# EAGLE design Adafruit Audio BFF PCB (EAGLE 9.6.2)
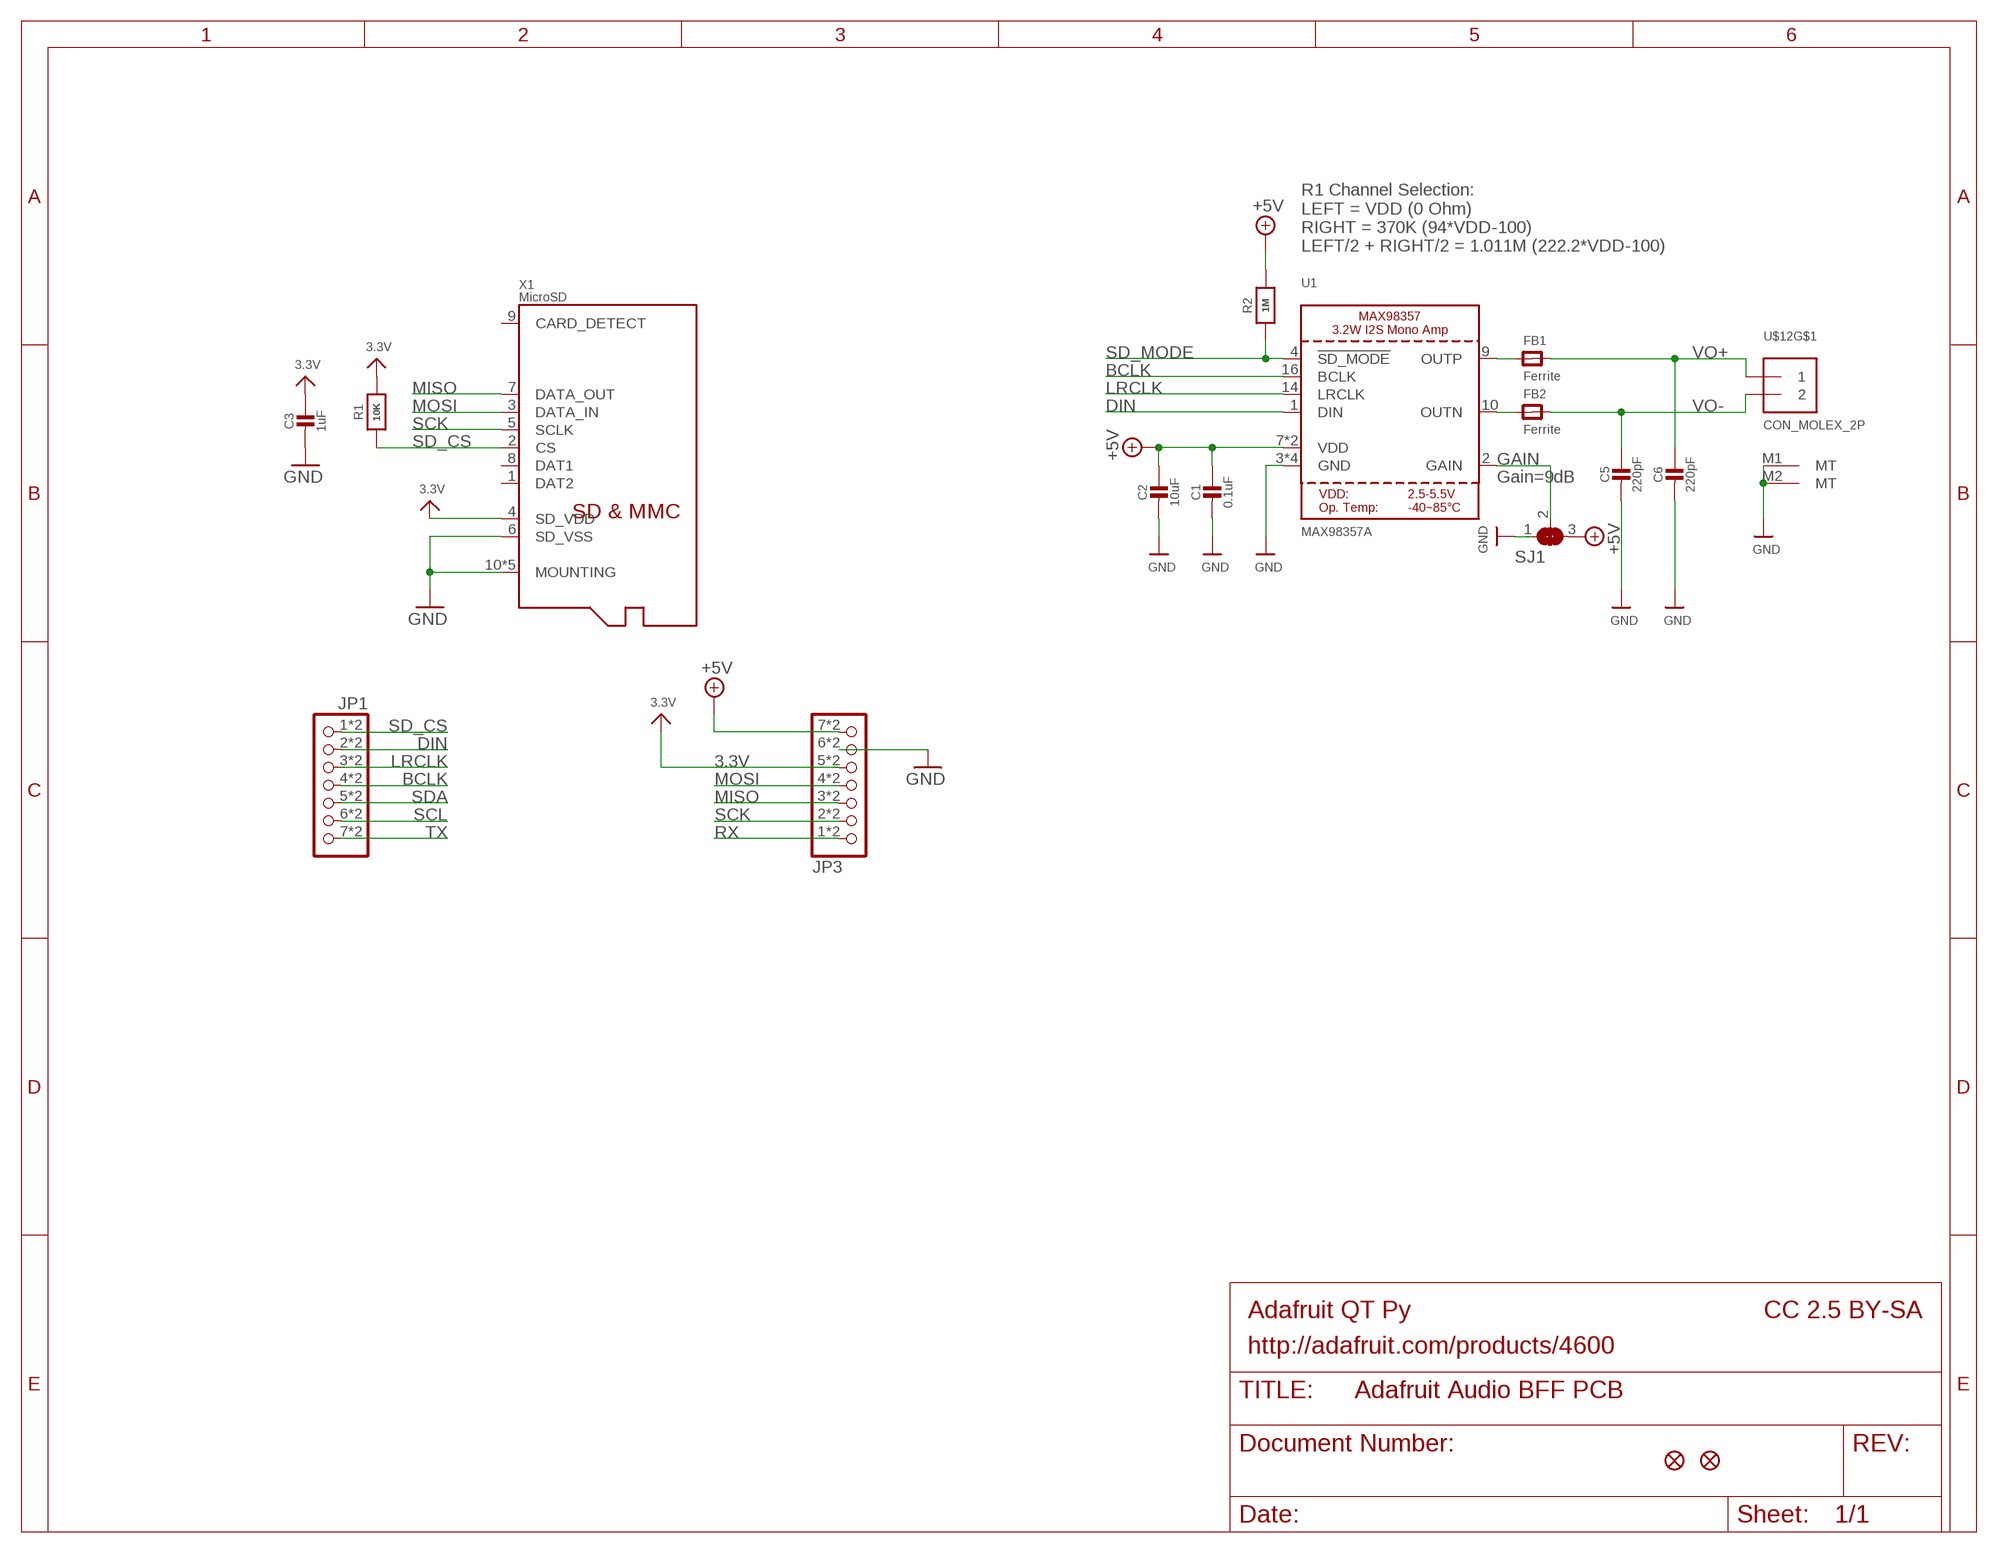
[diagram p0: schematic, sheet 1]

## Parts
C1  0.1uF  CAP_CERAMIC_0402NO  [_0402NO]
C2  10uF  CAP_CERAMIC0805-NOOUTLINE  [0805-NO]
C3  1uF  CAP_CERAMIC_0402NO  [_0402NO]
C5  220pF  CAP_CERAMIC_0402NO  [_0402NO]
C6  220pF  CAP_CERAMIC_0402NO  [_0402NO]
FB1  Ferrite  FERRITE_0402  [_0402]
FB2  Ferrite  FERRITE_0402  [_0402]
JP1  HEADER-1X7_CASTEL  [1X07_CASTEL]
JP3  HEADER-1X7_CASTEL  [1X07_CASTEL]
R1  10K  RESISTOR_0402NO  [_0402NO]
R2  1M  RESISTOR_0402NO  [_0402NO]
SJ1  SOLDERJUMPER_2WAY  [SOLDERJUMPER_2WAY_OPEN_NOPASTE]
U1  MAX98357A  AUDIOAMP_MAX98357  [QFN16_3MM]
U$6  FIDUCIAL_1MM  [FIDUCIAL_1MM]
U$8  FIDUCIAL_1MM  [FIDUCIAL_1MM]
U$12  CON_MOLEX_2P  [53398-0271]
X1  MicroSD  MICROSD104031-0811  [MOLEX_104031-0811]

## Nets
3.3V: C3.1 JP3.5 JP3.5C R1.2 X1.4(SD_VDD)
+5V [power]: C1.1 C2.1 JP3.7 JP3.7C R2.2 SJ1.3 U1.7(VDD) U1.8(VDD)
BCLK: JP1.4 JP1.4C U1.16(BCLK)
DIN: JP1.2 JP1.2C U1.1(DIN)
GAIN: SJ1.2 U1.2(GAIN)
GND [power]: C1.2 C2.2 C3.2 C5.2 C6.2 JP3.6 JP3.6C SJ1.1 U1.3(GND) U1.11(GND) U1.15(GND) U1.THERMAL(GND) U$12.M1(MT) U$12.M2(MT) X1.6(SD_VSS) X1.10(MOUNTING) X1.G1(MOUNTING) X1.G2(MOUNTING) X1.G3(MOUNTING) X1.G4(MOUNTING)
LRCLK: JP1.3 JP1.3C U1.14(LRCLK)
MISO: JP3.3 JP3.3C X1.7(DATA_OUT)
MOSI: JP3.4 JP3.4C X1.3(DATA_IN)
N$5: FB2.1 U1.10(OUTN)
N$6: FB1.1 U1.9(OUTP)
RX: JP3.1 JP3.1C
SCK: JP3.2 JP3.2C X1.5(SCLK)
SCL: JP1.6 JP1.6C
SD_CS: JP1.1 JP1.1C R1.1 X1.2(CS)
SD_MODE: R2.1 U1.4(!SD_MODE)
SDA: JP1.5 JP1.5C
TX: JP1.7 JP1.7C
VO+: C6.1 FB1.2 U$12.1
VO-: C5.1 FB2.2 U$12.2
Unconnected: X1.1(DAT2) X1.8(DAT1) X1.9(CARD_DETECT)

## Notes on the sheet
- R1 Channel Selection:
  LEFT = VDD (0 Ohm)
  RIGHT = 370K (94*VDD-100)
  LEFT/2 + RIGHT/2 = 1.011M (222.2*VDD-100)
- Gain=9dB
- Adafruit QT Py | CC 2.5 BY-SA
- http://adafruit.com/products/4600

## Library data of the parts
C1-C3 C5 C6 = microbuilder:CAP_CERAMIC: Ceramic Capacitors For new designs, use the packages preceded by an '_' character since they are more reliable: The following footprints should be used on most boards: _0402 - Standard footprint for regular board layouts _0603 - Standard footprint for regular board layouts _0805 - Standard footprint for regular board layouts _1206 - Standard footprint for regular board layouts For extremely tight-pitch boards where space is at a premium, the following 'micro-pitch' footprints can be used (smaller pads, no silkscreen outline, etc.): _0402MP - Micro-pitch footprint for very dense/compact boards _0603MP - Micro-pitch footprint for very dense/compact boards _0805MP - Micro-pitch footprint for very dense/compact boards _1206MP - Micro-pitch footprint for very dense/compact boards
FB1 FB2 = microbuilder:FERRITE: Ferrite Bead 0603 MMZ1608B121C - 120 Ohm @ 100MHz, 600mA, 0.15 Ohm DC Resistance - Digikey: 445-2164-1-ND BK1608HW121-T - 120 Ohm, 600mA Ferrite Chip - Digikey: 587-1876-2-ND 0805 HZ0805B272R-10 - 2.7K Ohm @ 100MHz, 200mA, 0.8 Ohm DC Resistance - Digikey: 240-2504-1-ND (see also Murata BLM21BD272SN1L) MMZ2012Y152B - 1.5K Ohm @ 100MHz, 500mA, 0.4 Ohm DC Resistance - Digikey: 445-1560-1-ND - Mainly for high frequency (80-400MHz) MMZ2012R102A - 1K Ohm @ 100MHz, 500mA, 0.3 Ohm DC Resistance - Digikey: 445-1555-2-ND - More general purpose (10-200MHz)
JP1 JP3 = adafruit_electromech:HEADER-1X7: PIN HEADER
R1 R2 = microbuilder:RESISTOR: Resistors For new designs, use the packages preceded by an '_' character since they are more reliable: The following footprints should be used on most boards: _0402 - Standard footprint for regular board layouts _0603 - Standard footprint for regular board layouts _0805 - Standard footprint for regular board layouts _1206 - Standard footprint for regular board layouts For extremely tight-pitch boards where space is at a premium, the following 'micro-pitch' footprints can be used (smaller pads, no silkscreen outline, etc.): _0402MP - Micro-pitch footprint for very dense/compact boards _0603MP - Micro-pitch footprint for very dense/compact boards _0805MP - Micro-pitch footprint for very dense/compact boards _1206MP - Micro-pitch footprint for very dense/compact boards
SJ1 = microbuilder:SOLDERJUMPER_2WAY: 2-Way Solder Jumper
U1 = microbuilder:AUDIOAMP_MAX98357: MAX98357 - 3.2W I2S Mono Audio Amp; ROT: 270
U$6 U$8 = microbuilder:FIDUCIAL: Fiducial Alignment Points Various fiducial points for machine vision alignment.; BOM: EXCLUDE
U$12 = adafruit_electromech:CON_MOLEX_2P
X1 = adafruit_electromech:MICROSD: MicroSD/Transflash Card Holder with SPI pinout 3M: 2908-05WB-MG 4UConnector: 19656 Footprint courtesy: Adafruit Industries

## Net classes
1 power: width 0.305 mm
2 thickpower: width 0.406 mm

## Board
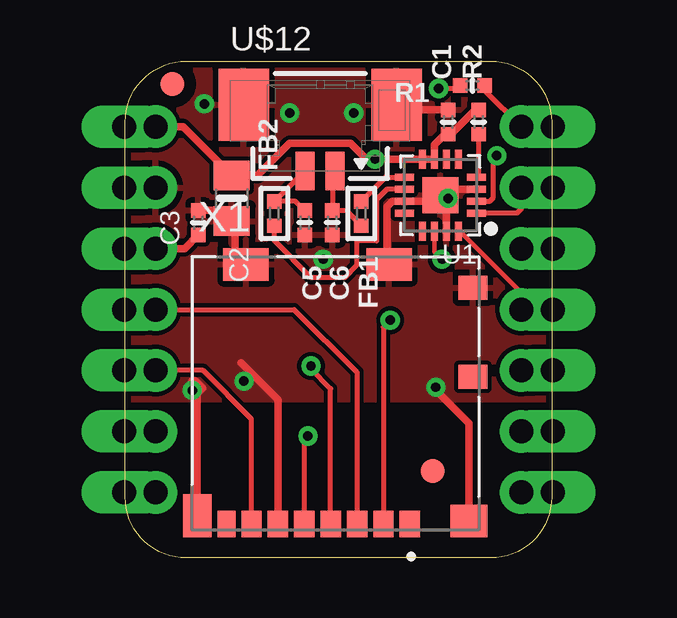
[diagram p1: board, top side]
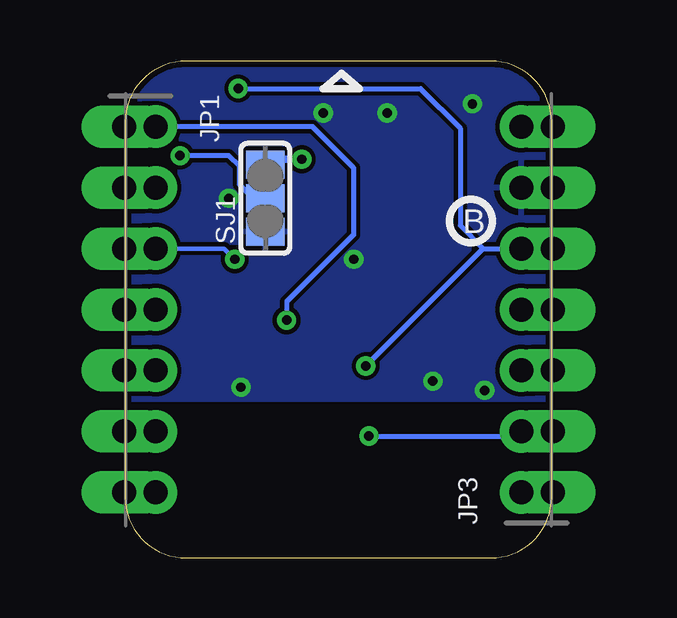
[diagram p2: board, bottom side, seen from below]

Size 17.78 x 20.7 mm. Coordinates in mm from the lower left corner, seen from the top.
Outline: 17.78,18.16 17.78,2.54 arc-90 15.24,0 2.54,0 arc-90 0,2.54 0,18.16 arc-90 2.54,20.7 15.24,20.7 arc-90 17.78,18.16
Copper layers (1*16): Top 0.035mm / dielectric 1.5mm / Bottom 0.035mm
Design rules "adafruit 7-7": minimum track width 7mil, minimum drill 15.5mil, track to track 7mil, track to pad 7mil, pad to pad 7mil, via to via 7mil, smd to smd 7mil, copper to edge 10mil, drill to drill 8mil, minimum pad ring 7mil, minimum via ring 8mil, stop-mask expansion 2mil, vias tented up to drill 20mil, thermal gap 10mil

### Footprints (pad centres in the part's own frame; a part is rotated, then mirrored left to right if it is on the bottom)
_0402NO = smd 0.6 x 0.6: 1 -0.508,0; 2 0.508,0
0805-NO = smd 1.24 x 1.5: 1 -0.95,0; 2 0.95,0
_0402 = smd 0.6 x 0.6: 1 -0.508,0; 2 0.508,0
1X07_CASTEL = drill 1 pad 1.778: 1 -7.62,0; 2 -5.08,0; 3 -2.54,0; 4 0,0; 5 2.54,0; 6 5.08,0; 7 7.62,0 | drill 1 pad 1.778 long: 1C -7.62,-1.324; 2C -5.08,-1.324; 3C -2.54,-1.324; 4C 0,-1.324; 5C 2.54,-1.324; 6C 5.08,-1.324; 7C 7.62,-1.324
SOLDERJUMPER_2WAY_OPEN_NOPASTE = smd 1.168 x 1.6: 1 -1.397,0; 2 0,0; 3 1.397,0
QFN16_3MM = smd 0.8 x 0.28: 1 -1.5,0.75; 2 -1.5,0.25; 3 -1.5,-0.25; 4 -1.5,-0.75; 9 1.5,-0.75; 10 1.5,-0.25; 11 1.5,0.25; 12 1.5,0.75 | smd 0.28 x 0.8: 5 -0.75,-1.5; 6 -0.25,-1.5; 7 0.25,-1.5; 8 0.75,-1.5; 13 0.75,1.5; 14 0.25,1.5; 15 -0.25,1.5; 16 -0.75,1.5 | smd 1.5 x 1.5: THERMAL 0,0
FIDUCIAL_1MM = smd 1 x 1: 1 0,0
53398-0271 = smd 0.8 x 1.6: 1 0.625,-1.27; 2 -0.625,-1.27 | smd 2.1 x 3: M1 3.185,1.48; M2 -3.185,1.48
MOLEX_104031-0811 = smd 0.85 x 1.1: 1 3.105,-5.45; 2 2.005,-5.45; 3 0.905,-5.45; 4 -0.195,-5.45; 5 -1.295,-5.45; 6 -2.395,-5.45; 7 -3.495,-5.45 | smd 0.75 x 1.1: 8 -4.545,-5.45 | smd 1.2 x 1: 9 5.74,0.7; 10 5.74,4.4 | smd 1.55 x 1.35: G1 5.565,-5.325 | smd 1.17 x 1.8: G2 -5.755,-5.1 | smd 1.9 x 1.35: G3 -3.73,5.375; G4 2.24,5.375

### Placement (x,y rotation side)
C1  13.46,18.16 90 top
C2  4.45,14.99 270 top
C3  3.05,13.97 90 top
C5  7.49,13.97 270 top
C6  8.64,13.97 270 top
FB1  9.84,14.35 270 top
FB2  6.22,14.35 90 top
JP1  16.51,10.35 270 bottom
JP3  1.27,10.35 90 bottom
PLABEL6  [PLABEL6]  8.76,18.16 0 bottom
PLABEL7  [PLABEL7]  2.92,17.91 90 top
PLABEL8  [PLABEL8]  2.92,15.49 90 top
PLABEL9  [PLABEL9]  1.65,1.14 0 top
PLABEL10  [PLABEL10]  15.94,1.08 0 top
PLABEL11  [PLABEL11]  16.19,19.49 0 top
PLABEL12  [PLABEL12]  9.27,7.75 0 bottom
PLABEL13  [PLABEL13]  8.89,1.59 0 bottom
PLABEL14  [PLABEL14]  13.97,16.64 0 bottom
PLABEL15  [PLABEL15]  13.97,13.46 0 bottom
PLABEL16  [PLABEL16]  13.97,14.99 0 bottom
PLABEL17  [PLABEL17]  10.16,14.92 90 bottom
R1  14.48,19.68 180 top
R2  14.73,18.16 90 top
SJ1  11.94,14.99 90 bottom
U1  13.14,15.11 180 top
U$3  [PCBFEAT-REV-040]  3.37,14.03 0 bottom
U$6  12.81,3.62 180 top
U$8  1.97,19.75 180 top
U$12  8.13,17.4 0 top
X1  8.76,6.86 0 top

### Tracks (layer width: path | path; a pad name or v marks a point on that pad's centre or on a via)
3.3V  (via drill 0.39)
  Top 0.203: R1.2 13.84,19.56 v13.07,19.56 | X1.4 8.57,7.05 7.75,7.87 v7.75,8
  Top 0.305: JP3.5C JP3.5 2.48,12.89 C3.1
  Bottom 0.203: v13.07,19.56 5.46,19.56 3.81,17.91 3.81,13.84 2.86,12.89 | v7.75,8 2.86,12.89 | 2.86,12.89 JP3.5
+5V  (via drill 0.39)
  Top 0.305: R2.2 14.61,18.67 13.59,17.65 C1.1 13.34,17.65 12.89,17.21 U1.7 U1.8 v10.41,16.61 10.06,16.61 9.4,17.27 6.86,17.27 5.52,15.94 C2.1 2.41,17.97 JP3.7 JP3.7C
  Bottom 0.305: SJ1.3 11.71,16.61 v10.41,16.61
BCLK
  Top 0.178: U1.16 13.95,13.61 16.51,11.05 JP1.4
  Top 0.305: JP1.4C JP1.4
DIN
  Top 0.203: U1.1 16.33,14.36 16.51,14.54 JP1.2 JP1.2C
GAIN  (via drill 0.39)
  Top 0.203: U1.2 15.22,14.86 15.33,14.98 15.33,16.6 v15.49,16.76
  Bottom 0.203: SJ1.2 12.45,14.99 13.02,15.56 13.02,16.32 13.46,16.76 v15.49,16.76
GND  (via drill 0.39)
  Top 0.305: U1.3 13.71,15.36 13.53,15.18 | X1.G4 10.91,12.33 10.91,14.63 11.14,14.86 U1.11 12.89,14.86 U1.THERMAL 13.37,15.34 13.4,15.3 | 13.4,15.3 U1.15 | 13.71,14.99 13.53,15.18 | 13.53,15.18 13.4,15.3 | X1.6 6.37,6.59 4.83,8.13 | X1.G2 3.01,6.84 3.23,7.07 2.92,7.38 2.79,7.38 | X1.G1 14.33,5.61 12.95,6.99 v12.95,7.11 | C1.2 11.52,18.67 U$12.M1 | C3.2 4,14.48 C2.2 4.57,13.91 4.57,12.69 X1.G3
  other vias: 2.79,6.99 4.95,7.37 13.46,14.99 8.26,12.45 6.86,18.54 9.53,18.54 3.3,18.92
  pour Top: 17.78,20.7 0,20.7 0.13,6.6 17.78,6.6
  pour Bottom: 17.78,20.7 0,20.7 0,6.6 17.78,6.6
LRCLK  (via drill 0.39)
  Top 0.178: v13.21,12.45 12.89,12.76 U1.14
  Top 0.203: JP1.3C JP1.3
  Bottom 0.178: v13.21,12.45 13.65,12.89 JP1.3
MISO
  Top 0.203: X1.7 5.27,5.78 3.24,7.81 JP3.3
  Top 0.305: JP3.3C JP3.3
MOSI
  Top 0.203: JP3.4 7.05,10.35 9.67,7.73 X1.3
  Top 0.305: JP3.4C JP3.4
N$5
  Top 0.203: U1.10 10.92,15.36 10.48,14.92 10.48,13.21 9.65,13.21 9.65,12.19 9.14,11.68 7.75,11.68 6.22,13.21 FB2.1
N$6
  Top 0.203: FB1.1 10.85,15.86 U1.9
RX
  Top 0.305: JP3.1C JP3.1 | JP3.1 1.71,2.73 1.78,2.67 1.33,2.67 JP3.1
SCK  (via drill 0.39)
  Top 0.203: X1.5 7.47,4.93 v7.62,5.08
  Top 0.305: JP3.2C JP3.2
  Bottom 0.203: v7.62,5.08 1.46,5.08 JP3.2
SCL
  Top 0.305: JP1.6C JP1.6
SD_CS  (via drill 0.39)
  Top 0.203: R1.1 14.99,19.49 JP1.1 | v11.05,9.91 10.77,9.62 X1.2
  Bottom 0.203: v11.05,9.91 11.05,10.67 8.26,13.46 8.26,16.26 9.97,17.97 JP1.1 JP1.1C
SD_MODE
  Top 0.203: R2.1 14.73,15.95 U1.4
SDA
  Top 0.305: JP1.5C JP1.5
TX
  Top 0.305: JP1.7C JP1.7
VO+
  Top 0.203: U$12.1 8.64,16.01 C6.1 9.21,14.48 FB1.2
VO-
  Top 0.203: U$12.2 6.23,14.86 FB2.2 7.11,14.86 C5.1

### Text on the board
Pinguin_tBackup: 5V | A0 | A0 | 5V | NP | Sw | G | CS | RX | TX | A0 | A1 | R | RX | BFF | TX | T | MicroSD / BFF
Pinguin_bBackup: USB | 12 | Gain | 9 | 6 | MicroSD Card / SPI interface + / Card CS on TX / QT Py. Solder / back to / back | Audio BFF / MAX98357 / I2S 3W Amp / & MicroSD | SDCS: A0, DAT: A1 / LR: A2, BCLK: A3